# Altium project PCB_Project1.PrjPCB
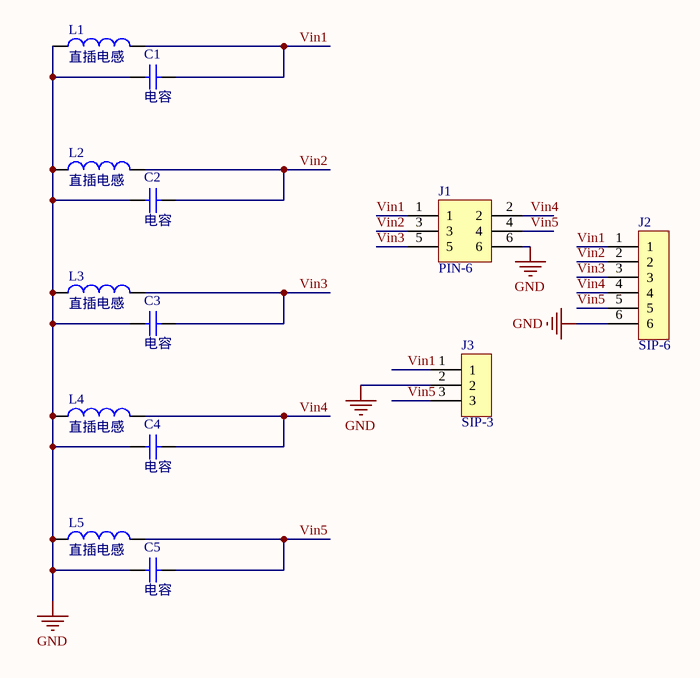
[diagram p0: Sheet1.SchDoc]
1 sheet, 13 parts. Net scope: global (net labels, ports and power ports of the same name join across sheets).
Board file: PCB1.PcbDoc

## Sheet Sheet1.SchDoc
size A4

### Parts
C1  电容  [5mm]
C2  电容  [5mm]
C3  电容  [5mm]
C4  电容  [5mm]
C5  电容  [5mm]
J1  PIN-6  [2.54简易牛角座6P]
J2  SIP-6  [2.54排针1X6]
J3  SIP-3  [XH2.54-3SMD]
L1  直插电感  [L8*10_4p_L]
L2  直插电感  [L8*10_4p_L]
L3  直插电感  [L8*10_4p_C]
L4  直插电感  [L8*10_4p_R]
L5  直插电感  [L8*10_4p_R]

### Nets
GND: C1.1 C2.1 C3.1 C4.1 C5.1 J1.6 J2.6 J3.2 L1.1 L2.1 L3.1 L4.1 L5.1
Vin1: C1.2 J1.1 J2.1 J3.1 L1.2
Vin2: C2.2 J1.3 J2.2 L2.2
Vin3: C3.2 J1.5 J2.3 L3.2
Vin4: C4.2 J1.2 J2.4 L4.2
Vin5: C5.2 J1.4 J2.5 J3.3 L5.2

### Library data of the parts
C1-C5 = 电容: Capacitor; Value: 22pF; Published: 8-Jun-2000; LatestRevisionDate: 17-Jul-2002; LatestRevisionNote: Re-released for DXP Platform.; PackageReference: RAD-0.3; Publisher: Altium Limited; PackageDescription: Radial Cap, Thru-Hole; 2 Leads; 0.3 in Pin Spacing